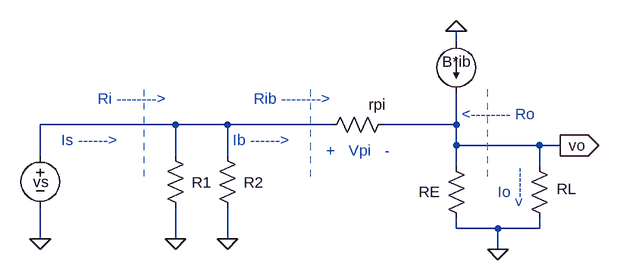
[diagram p0: schematic prob6_56D_AC_small-signal.asc]
prob6_56D_AC_small-signal.asc, the LTspice schematic file:
Version 4
SHEET 1 996 680
WIRE 640 -32 640 -48
WIRE 208 96 0 96
WIRE 288 96 208 96
WIRE 448 96 288 96
WIRE 640 96 640 48
WIRE 640 96 528 96
WIRE 640 128 640 96
WIRE 768 128 640 128
WIRE 800 128 768 128
WIRE 0 144 0 96
WIRE 208 144 208 96
WIRE 288 144 288 96
WIRE 640 160 640 128
WIRE 768 160 768 128
WIRE 640 256 640 240
WIRE 704 256 640 256
WIRE 768 256 768 240
WIRE 768 256 704 256
WIRE 0 272 0 224
WIRE 208 272 208 224
WIRE 288 272 288 224
WIRE 704 288 704 256
FLAG 0 272 0
FLAG 704 288 0
FLAG 208 272 0
FLAG 640 -48 0
FLAG 288 272 0
FLAG 800 128 vo
IOPIN 800 128 Out
SYMBOL res 272 128 R0
WINDOW 0 41 57 Left 2
SYMATTR InstName R2
SYMATTR Value ""
SYMBOL res 544 80 R90
WINDOW 0 1 25 VBottom 2
WINDOW 3 32 56 VTop 2
SYMATTR InstName rpi
SYMATTR Value ""
SYMBOL res 656 256 R180
WINDOW 0 41 56 Left 2
WINDOW 3 36 40 Left 2
SYMATTR InstName RE
SYMATTR Value ""
SYMBOL current 640 -32 R0
WINDOW 0 -22 31 Left 2
SYMATTR InstName B*ib
SYMATTR Value ""
SYMBOL res 784 256 R180
WINDOW 0 -41 61 Left 2
WINDOW 3 36 40 Left 2
SYMATTR InstName RL
SYMATTR Value ""
SYMBOL res 192 128 R0
WINDOW 0 41 57 Left 2
SYMATTR InstName R1
SYMATTR Value ""
SYMBOL voltage 0 128 R0
WINDOW 0 -11 56 Left 2
SYMATTR InstName vs
SYMATTR Value ""
TEXT 328 56 Left 2 ;Rib -------->
TEXT 88 56 Left 2 ;Ri -------->
TEXT 648 80 Left 2 ;<-------- Ro
TEXT 440 136 Left 2 ;+   Vpi   -
TEXT 736 160 VRight 2 ;<------
TEXT 704 200 Left 2 ;Io
TEXT 296 120 Left 2 ;Ib ------>
TEXT 32 120 Left 2 ;Is ------>
LINE Normal 416 176 416 32 2
LINE Normal 160 176 160 32 2
LINE Normal 688 176 688 32 2

The netlist it stands for:
* prob6_56D_AC_small-signal.asc
R2 N001 0
rpi vo N001
RE 0 vo
I§B*ib 0 vo
RL 0 vo
R1 N001 0
vs N001 0
* Rib -------->
* Ri -------->
* <-------- Ro
* +   Vpi   -
* <------
* Io
* Ib ------>
* Is ------>
.backanno
.end